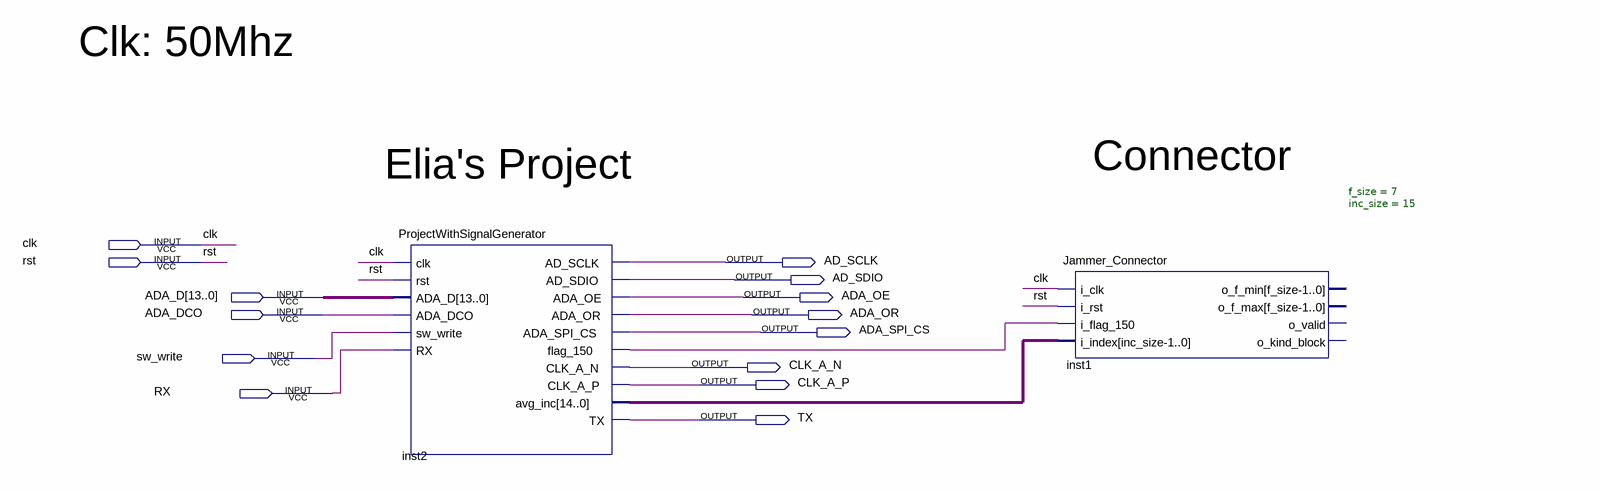
[diagram p0: schematic sheet]
// Quartus schematic Ortiada_BDF.bdf as structural Verilog: 2 symbols, 14 pins
module Ortiada_BDF (
  input  clk,
  input  rst,
  input  [13:0] ADA_D,
  input  ADA_DCO,
  input  sw_write,
  input  RX,
  output AD_SCLK,
  output AD_SDIO,
  output ADA_OE,
  output ADA_OR,
  output ADA_SPI_CS,
  output CLK_A_N,
  output CLK_A_P,
  output TX
);

  wire inst2_flag_150;
  wire [14:0] inst2_avg_inc;

  ProjectWithSignalGenerator inst2 (
    .clk(clk), .rst(rst), .ADA_D(ADA_D), .ADA_DCO(ADA_DCO), .sw_write(sw_write), .RX(RX), .AD_SCLK(AD_SCLK),
    .AD_SDIO(AD_SDIO), .ADA_OE(ADA_OE), .ADA_OR(ADA_OR), .ADA_SPI_CS(ADA_SPI_CS), .flag_150(inst2_flag_150),
    .CLK_A_N(CLK_A_N), .CLK_A_P(CLK_A_P), .avg_inc(inst2_avg_inc), .TX(TX));
  Jammer_Connector #(.f_size(7), .inc_size(15)) inst1 (
    .i_clk(clk), .i_rst(rst), .i_flag_150(inst2_flag_150), .i_index(inst2_avg_inc));  // open: o_f_min, o_f_max, o_valid, o_kind_block

  // Notes on the sheet:
  //   Clk: 50Mhz
  //   Connector
  //   Elia's Project
endmodule
